# Altium schematic sheet WiFiKernel.SchDoc
size A4
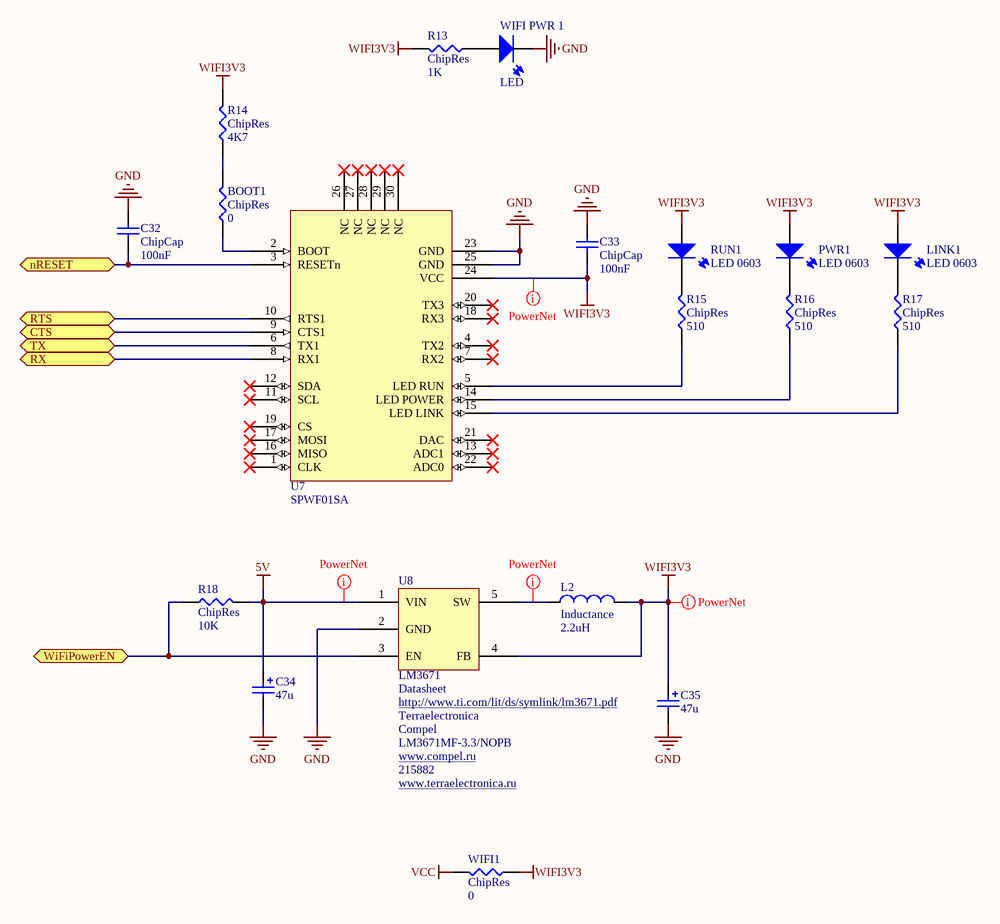
[diagram p0: WiFiKernel.SchDoc]

## Parts
BOOT1  ChipRes  value 0  [RES0805]
C32  ChipCap  value 100nF  [CAP0805]
C33  ChipCap  value 100nF  [CAP0805]
C34  value 47u  [CAPC7343]  (hidden comment: Cap Pol SMD)
C35  value 47u  [CAPC7343]  (hidden comment: Cap Pol SMD)
L2  Inductance  value 2.2uH  [CDRH2D14]
LINK1  LED 0603  [LED 0603]
PWR1  LED 0603  [LED 0603]
R13  ChipRes  value 1K  [RES0805]
R14  ChipRes  value 4K7  [RES0805]
R15  ChipRes  value 510  [RES0805]
R16  ChipRes  value 510  [RES0805]
R17  ChipRes  value 510  [RES0805]
R18  ChipRes  value 10K  [RES0805]
RUN1  LED 0603  [LED 0603]
U7  SPWF01SA  [SPWF01SA]
U8  LM3671  ComponentLink1Description: Datasheet  Supplier 1: Terraelectronica  Supplier 2: Compel  Supplier Part Number 2: LM3671MF-3.3/NOPB  Supplier Part Number 1: 215882  [SOT23-5]
WIFI1  ChipRes  value 0  [RES0805]
WIFI_PWR_1  LED  [PLCC-2]

## Ports
CTS, nRESET, RTS, RX, TX, WiFiPowerEN

## Nets
5V: C34.1 R18.2 U8.1(VIN)
GND: C32.1 C33.1 C34.2 C35.2 U7.23(GND) U7.25(GND) U8.2(GND) WIFI_PWR_1.1
VCC: WIFI1.2
WIFI3V3: C33.2 C35.1 L2.1 LINK1.2 PWR1.2 R13.2 R14.1 RUN1.2 U7.24(VCC) U8.4(FB) WIFI1.1
CTS: U7.9(CTS1) ; port CTS
nRESET: C32.2 U7.3(RESETn) ; port nRESET
RTS: U7.10(RTS1) ; port RTS
RX: U7.8(RX1) ; port RX
TX: U7.6(TX1) ; port TX
WiFiPowerEN: R18.1 U8.3(EN) ; port WiFiPowerEN
NetBOOT1_1: BOOT1.1 R14.2
NetBOOT1_2: BOOT1.2 U7.2(BOOT)
NetL2_2: L2.2 U8.5(SW)
NetLINK1_1: LINK1.1 R17.1
NetPWR1_1: PWR1.1 R16.1
NetR13_1: R13.1 WIFI_PWR_1.2
NetR15_1: R15.1 RUN1.1
NetR15_2: R15.2 U7.5(LED_RUN)
NetR16_2: R16.2 U7.14(LED_POWER)
NetR17_2: R17.2 U7.15(LED_LINK)

Not connected (* = marked no-connect by the designer): U7 1(CLK)* 4(TX2)* 7(RX2)* 11(SCL)* 12(SDA)* 13(ADC1)* 16(MISO)* 17(MOSI)* 18(RX3)* 19(CS)* 20(TX3)* 21(DAC)* 22(ADC0)* 26(NC)* 27(NC)* 28(NC)* 29(NC)* 30(NC)*

## Layout directives
net class Undefined: 5V, NetL2_2, WIFI3V3

## Library data of the parts
BOOT1 R13-R18 WIFI1 = ChipRes: Chip resistor
C32 C33 = ChipCap: Capacitor; Published: 8-Jun-2000; LatestRevisionDate: 17-Jul-2002; LatestRevisionNote: Re-released for DXP Platform.; PackageReference: RAD-0.3; Publisher: Altium Limited
C34 C35 = Cap Pol Chip: Polarized Capacitor (Radial); Supplier 1: Digi-Key; Supplier Part Number 1: 399-4029-1-ND
L2 = ChipInductance
LINK1 PWR1 RUN1 WIFI_PWR_1 = LED0603
U7 = SPWF01: Serial-to-Wi-Fi b/g/n intelligent module
U8 = LM3671MF: 600-mA Step-Down DC-DC Converter; ComponentLink1URL: http://www.ti.com/lit/ds/symlink/lm3671.pdf; Supplier URL 2: www.compel.ru; Supplier URL 1: www.terraelectronica.ru